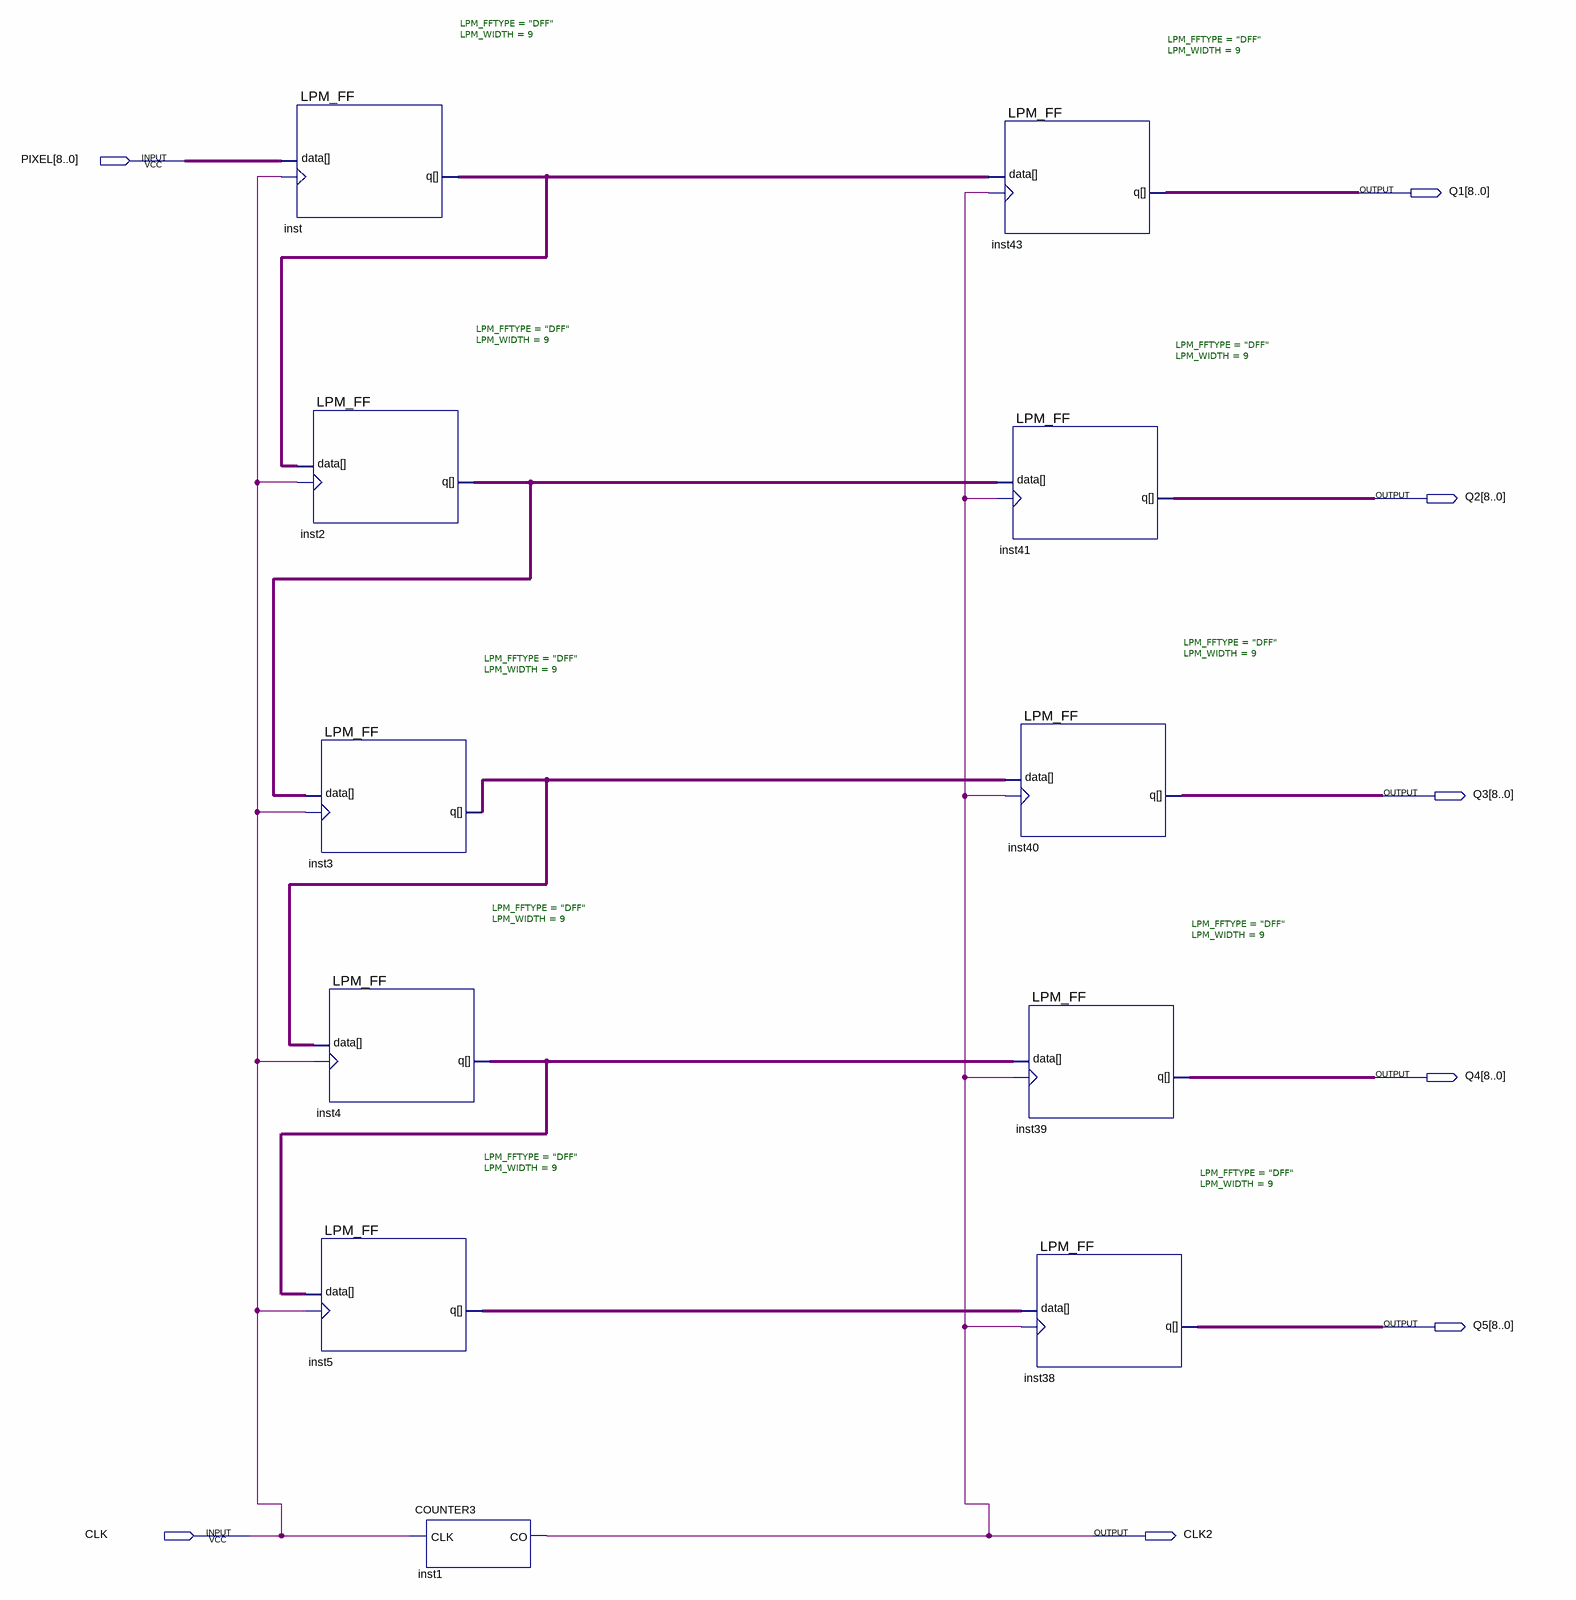
[diagram p0: schematic sheet]
// Quartus schematic SIPO9W.bdf as structural Verilog: 11 symbols, 8 pins
module SIPO9W (
  input  [8:0] PIXEL,
  input  CLK,
  output [8:0] Q1,
  output [8:0] Q2,
  output [8:0] Q3,
  output [8:0] Q4,
  output [8:0] Q5,
  output CLK2
);

  wire [8:0] inst2_q, inst3_q, inst4_q, inst5_q, inst_q;

  LPM_FF #(.LPM_FFTYPE("DFF"), .LPM_WIDTH(9)) inst (.clock(CLK), .data(PIXEL), .q(inst_q));
  LPM_FF #(.LPM_FFTYPE("DFF"), .LPM_WIDTH(9)) inst2 (.clock(CLK), .data(inst_q), .q(inst2_q));
  LPM_FF #(.LPM_FFTYPE("DFF"), .LPM_WIDTH(9)) inst3 (.clock(CLK), .data(inst2_q), .q(inst3_q));
  LPM_FF #(.LPM_FFTYPE("DFF"), .LPM_WIDTH(9)) inst4 (.clock(CLK), .data(inst3_q), .q(inst4_q));
  LPM_FF #(.LPM_FFTYPE("DFF"), .LPM_WIDTH(9)) inst5 (.clock(CLK), .data(inst4_q), .q(inst5_q));
  COUNTER3 inst1 (.CLK(CLK), .CO(CLK2));
  LPM_FF #(.LPM_FFTYPE("DFF"), .LPM_WIDTH(9)) inst43 (.clock(CLK2), .data(inst_q), .q(Q1));
  LPM_FF #(.LPM_FFTYPE("DFF"), .LPM_WIDTH(9)) inst41 (.clock(CLK2), .data(inst2_q), .q(Q2));
  LPM_FF #(.LPM_FFTYPE("DFF"), .LPM_WIDTH(9)) inst40 (.clock(CLK2), .data(inst3_q), .q(Q3));
  LPM_FF #(.LPM_FFTYPE("DFF"), .LPM_WIDTH(9)) inst39 (.clock(CLK2), .data(inst4_q), .q(Q4));
  LPM_FF #(.LPM_FFTYPE("DFF"), .LPM_WIDTH(9)) inst38 (.clock(CLK2), .data(inst5_q), .q(Q5));
endmodule
